# Altium schematic sheet RUMBA_plus.SchDoc
size 635 x 457 mm; PageSetup: Record=PageOptions|CenterHorizontal=True|CenterVertical=True|PrintScale=0.68|XCorrection=1.00|YCorrection=1.00|PrintKind=1|BorderSize=5000000|LeftOffset=0|BottomOffset=0|Orientation=2|PaperLength=1000|PaperWidth=1000|Scale=100|PaperSource=7|PrintQuality=-4|MediaType=1|DitherType=10|PrintScaleMode=1|PaperKind=A3
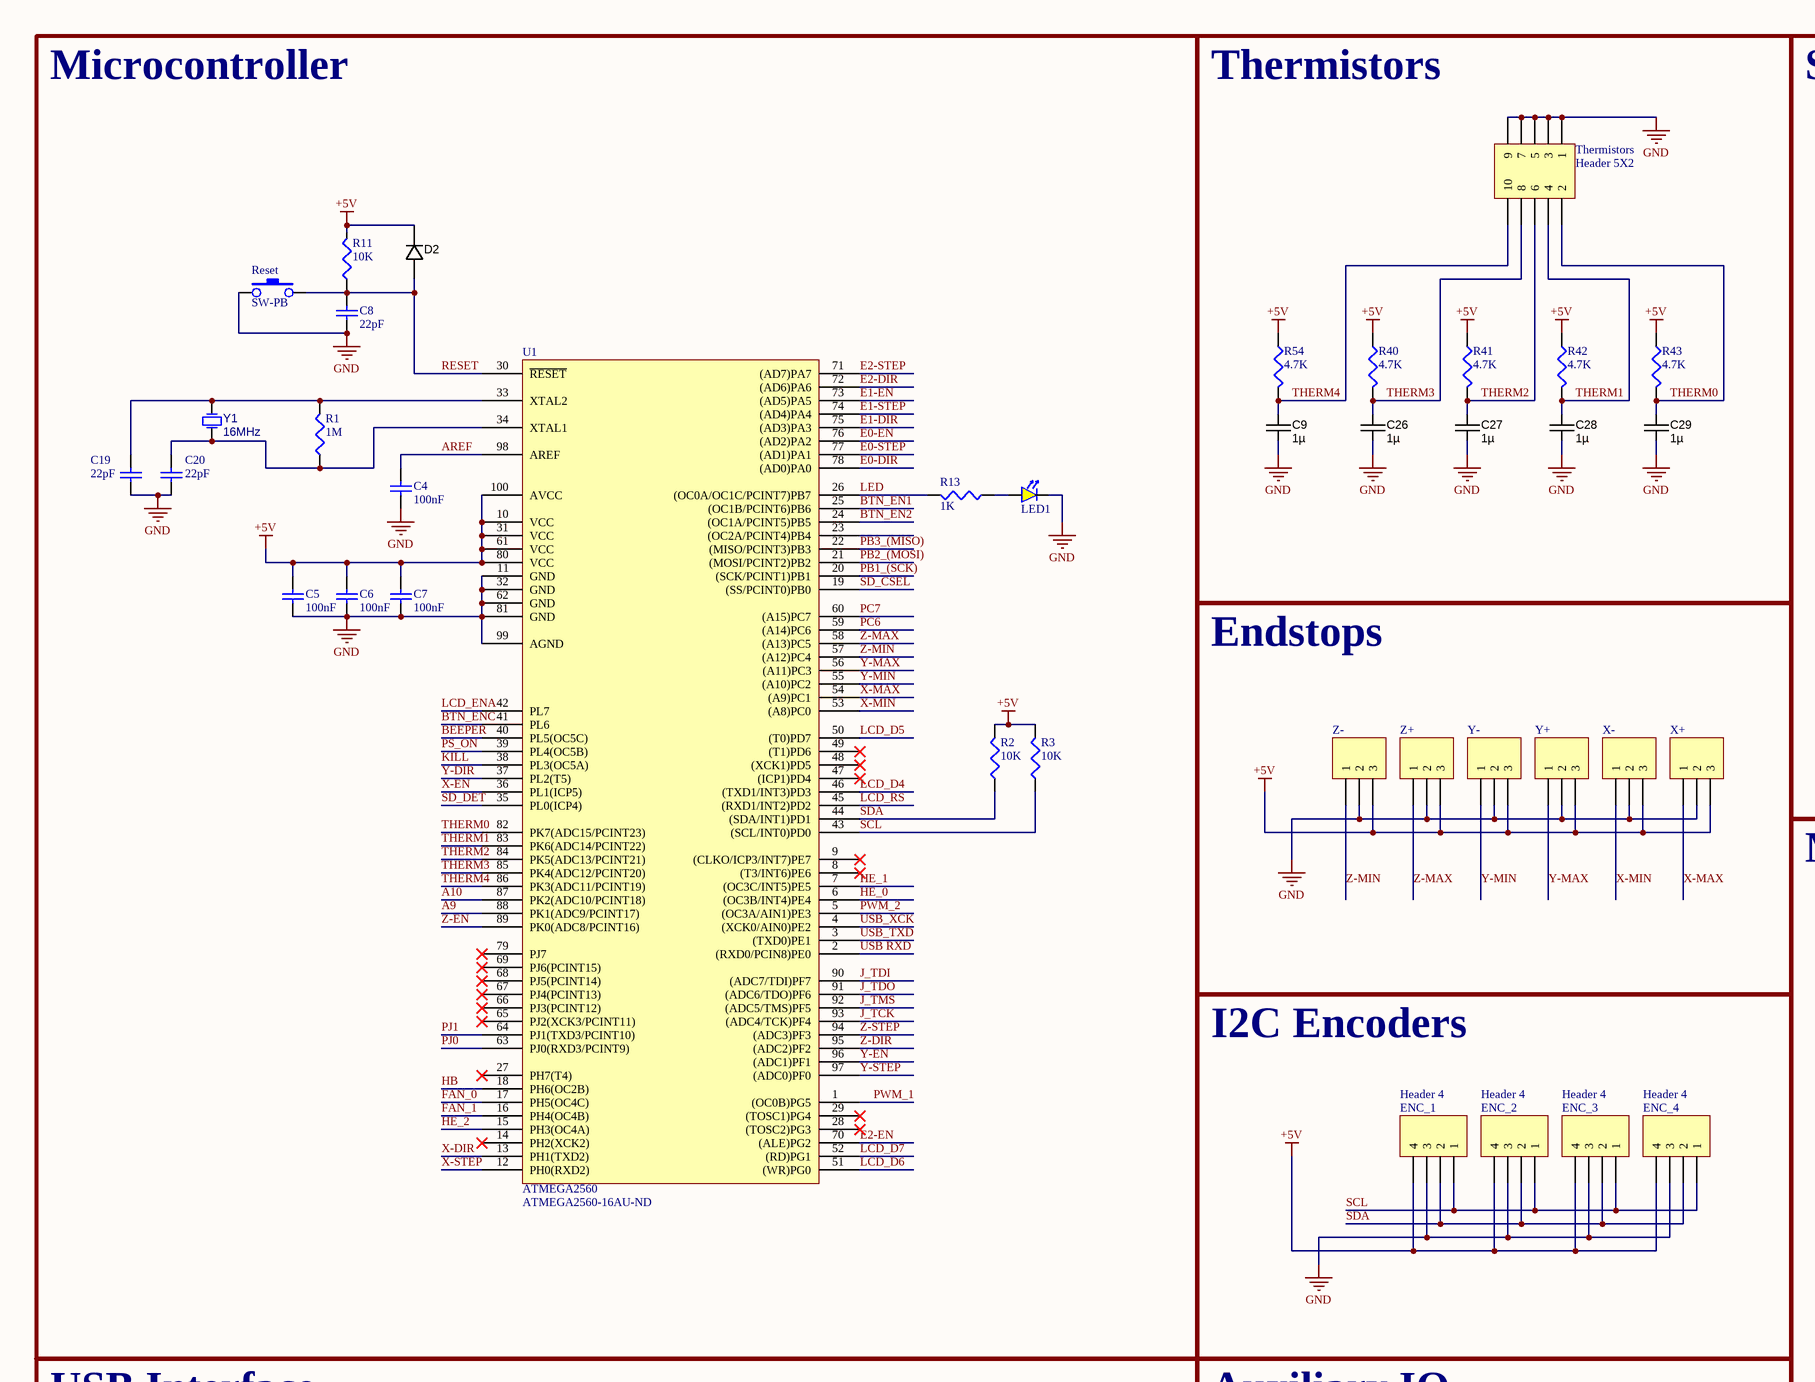
[diagram p0: RUMBA_plus.SchDoc, top left]
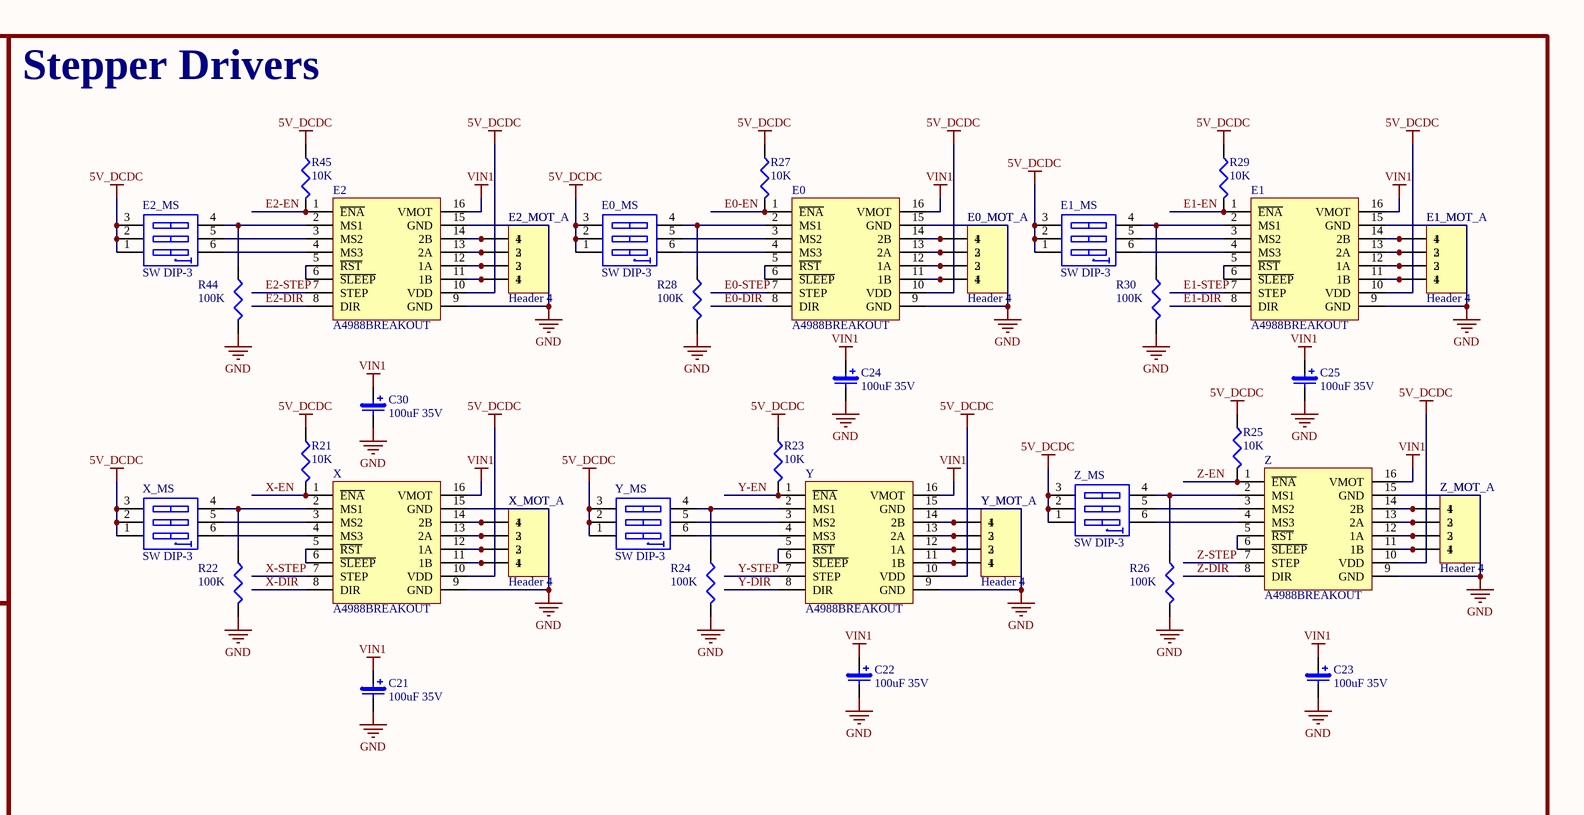
[diagram p1: RUMBA_plus.SchDoc, top right]
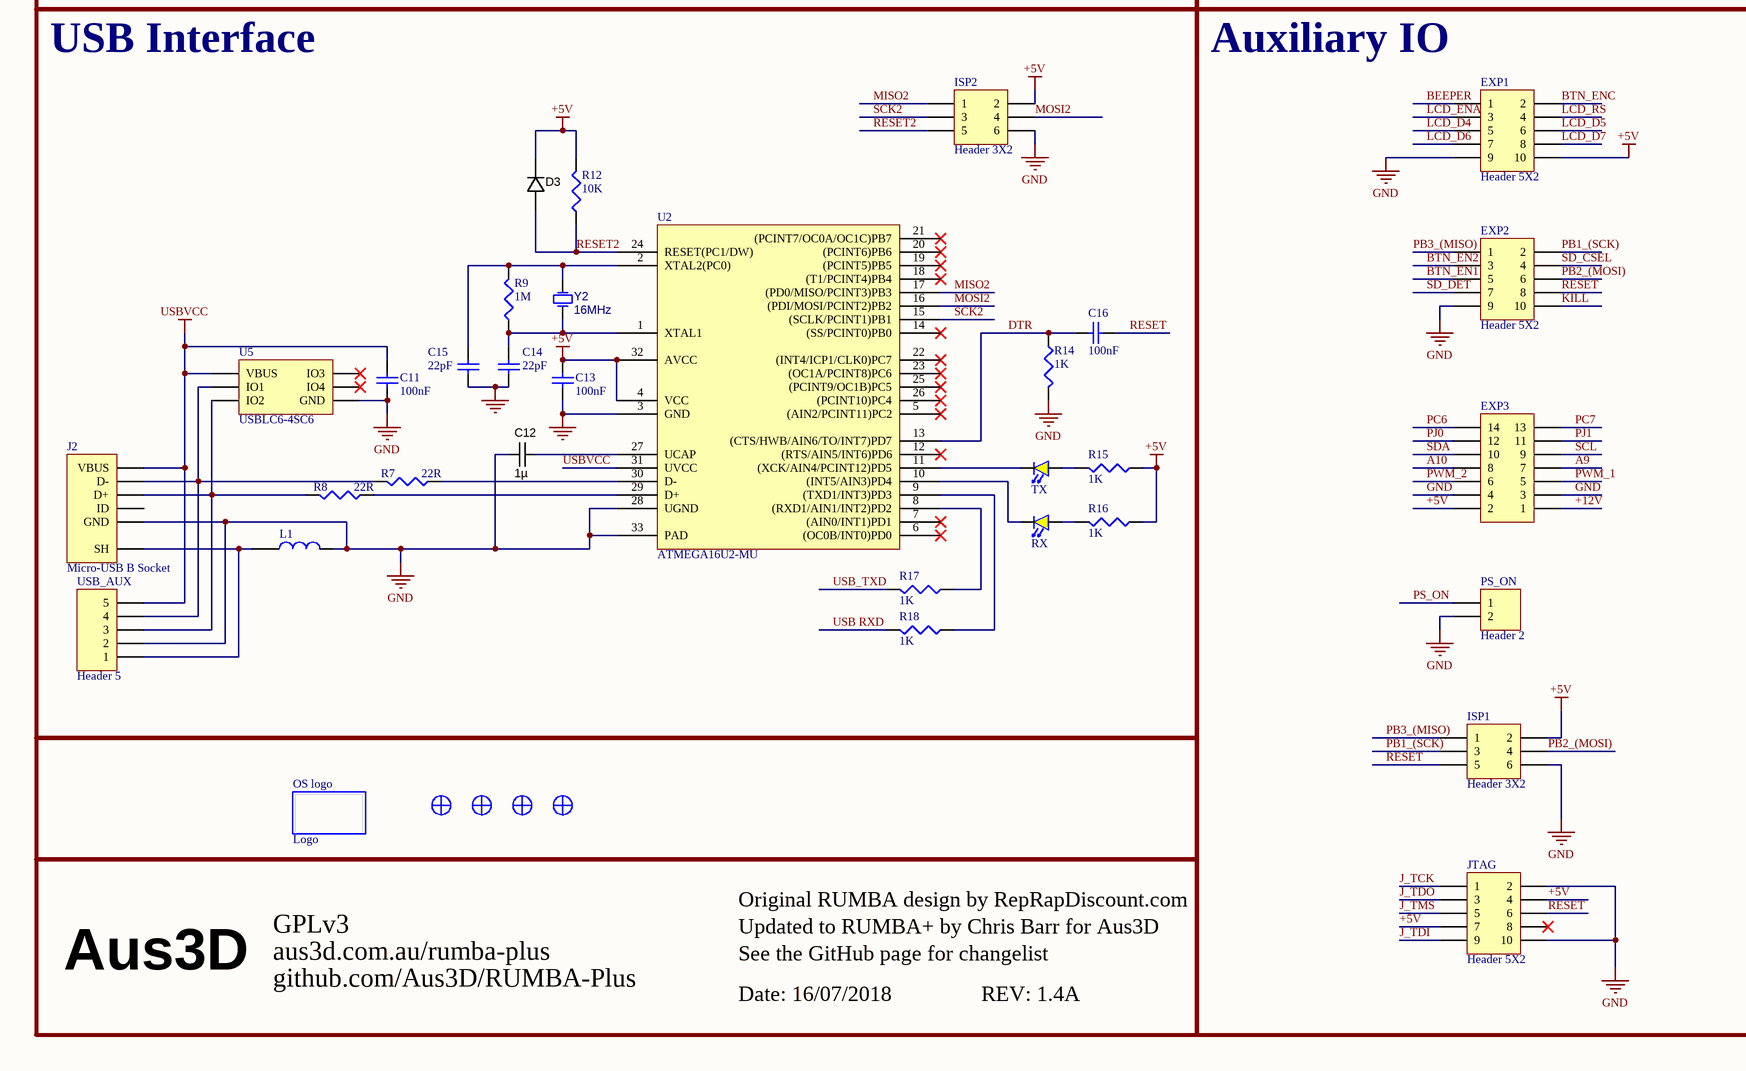
[diagram p2: RUMBA_plus.SchDoc, bottom left]
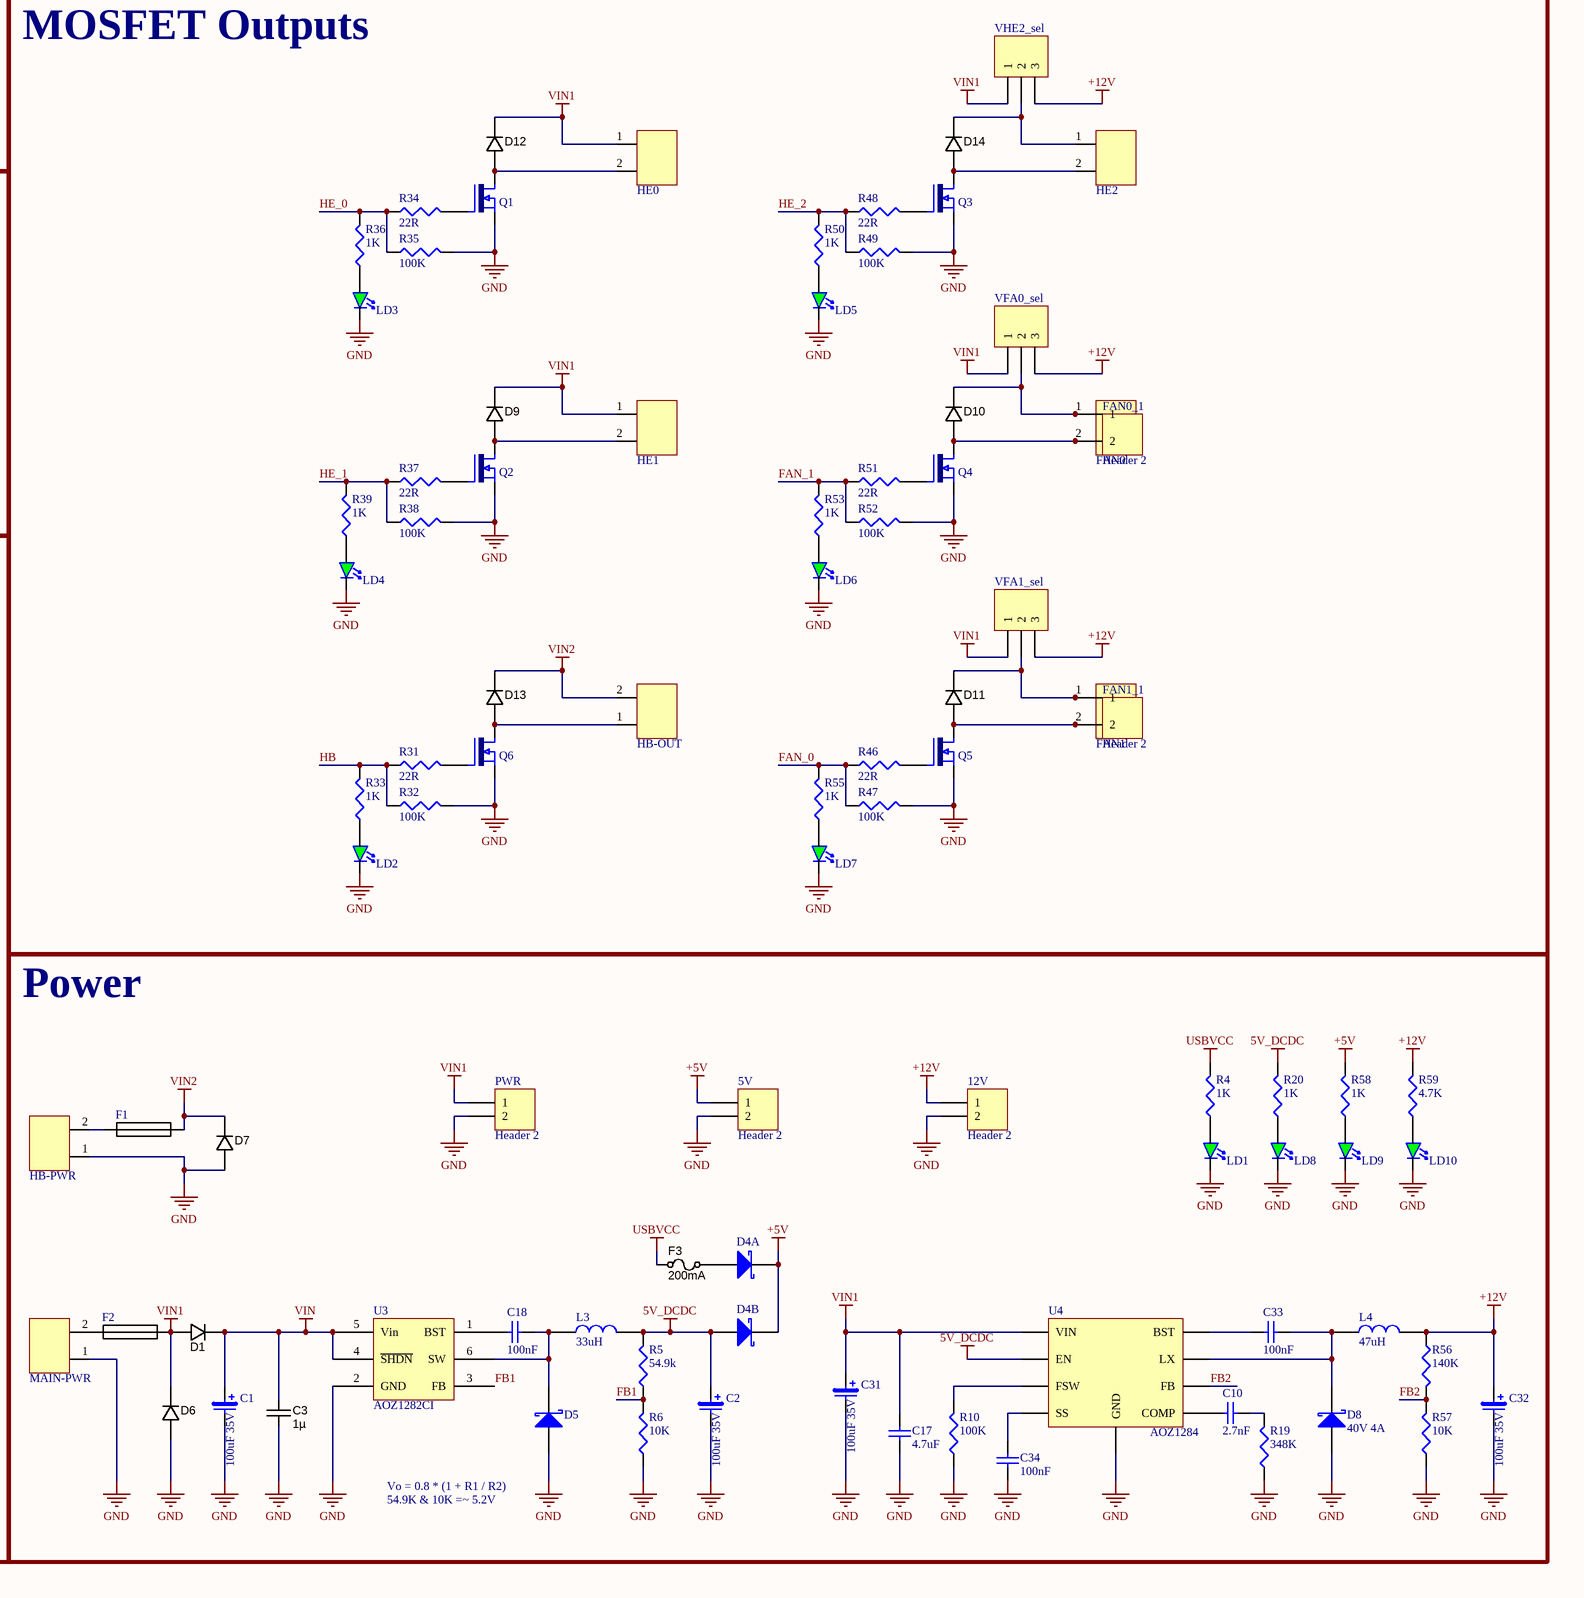
[diagram p3: RUMBA_plus.SchDoc, bottom right]

## Parts
5V  Header 2  [HDR1X2]
12V  Header 2  [HDR1X2]
C1  value 100uF 35V  [CAP EL PANASONIC]  (hidden comment: CapE-6.3-100uF-35V)
C2  value 100uF 35V  [CAP EL PANASONIC]  (hidden comment: CapE-6.3-100uF-35V)
C3  value 1µ  [Cap 1608-0603]  (hidden comment: approved sub OK)
C4  value 100nF  [Cap 1608-0603]  (hidden comment: CapC-0603-100nF)
C5  value 100nF  [Cap 1608-0603]  (hidden comment: CapC-0603-100nF)
C6  value 100nF  [Cap 1608-0603]  (hidden comment: CapC-0603-100nF)
C7  value 100nF  [Cap 1608-0603]  (hidden comment: CapC-0603-100nF)
C8  value 22pF  [Cap 1608-0603]  (hidden comment: CapC-0603-22pF)
C9  value 1µ  [Cap 1608-0603]  (hidden comment: approved sub OK)
C10  value 2.7nF  [Cap 1608-0603]  (hidden comment: CapC-0603-2.7nF)
C11  value 100nF  [Cap 1608-0603]  (hidden comment: CapC-0603-100nF)
C12  value 1µ  [Cap 1608-0603]  (hidden comment: approved sub OK)
C13  value 100nF  [Cap 1608-0603]  (hidden comment: CapC-0603-100nF)
C14  value 22pF  [Cap 1608-0603]  (hidden comment: CapC-0603-22pF)
C15  value 22pF  [Cap 1608-0603]  (hidden comment: CapC-0603-22pF)
C16  value 100nF  [Cap 1608-0603]  (hidden comment: CapC-0603-100nF)
C17  value 4.7uF  [CAP 3225-1210]  (hidden comment: CapC-1210-4.7uF-50V)
C18  value 100nF  [Cap 1608-0603]  (hidden comment: CapC-0603-100nF)
C19  value 22pF  [Cap 1608-0603]  (hidden comment: CapC-0603-22pF)
C20  value 22pF  [Cap 1608-0603]  (hidden comment: CapC-0603-22pF)
C21  value 100uF 35V  [CAP EL PANASONIC]  (hidden comment: CapE-6.3-100uF-35V)
C22  value 100uF 35V  [CAP EL PANASONIC]  (hidden comment: CapE-6.3-100uF-35V)
C23  value 100uF 35V  [CAP EL PANASONIC]  (hidden comment: CapE-6.3-100uF-35V)
C24  value 100uF 35V  [CAP EL PANASONIC]  (hidden comment: CapE-6.3-100uF-35V)
C25  value 100uF 35V  [CAP EL PANASONIC]  (hidden comment: CapE-6.3-100uF-35V)
C26  value 1µ  [Cap 1608-0603]  (hidden comment: approved sub OK)
C27  value 1µ  [Cap 1608-0603]  (hidden comment: approved sub OK)
C28  value 1µ  [Cap 1608-0603]  (hidden comment: approved sub OK)
C29  value 1µ  [Cap 1608-0603]  (hidden comment: approved sub OK)
C30  value 100uF 35V  [CAP EL PANASONIC]  (hidden comment: CapE-6.3-100uF-35V)
C31  value 100uF 35V  [CAP EL PANASONIC]  (hidden comment: CapE-6.3-100uF-35V)
C32  value 100uF 35V  [CAP EL PANASONIC]  (hidden comment: CapE-6.3-100uF-35V)
C33  value 100nF  [Cap 1608-0603]  (hidden comment: CapC-0603-100nF)
C34  value 100nF  [Cap 1608-0603]  (hidden comment: CapC-0603-100nF)
D1  100V; 1.5A  [DO-214AC]  (value not drawn)
D2  DIODE_75V_500mW  [SOD323]  (value not drawn)
D3  DIODE_75V_500mW  [SOD323]  (value not drawn)
D4  Diode Schottky 2A 20V Dual Common Cathode  [SOT1061]  (value not drawn)  (parts A,B of 2)
D5  Diode Schottky 2A 40V  [DIOM2616X08N]  (value not drawn)
D6  100V; 1.5A  [DO-214AC]  (value not drawn)
D7  100V; 1.5A  [DO-214AC]  (value not drawn)
D8  value 40V 4A  [DO-214AA]  (hidden comment: Diode SSB44-E3)
D9  100V; 1.5A  [DO-214AC]  (value not drawn)
D10  100V; 1.5A  [DO-214AC]  (value not drawn)
D11  100V; 1.5A  [DO-214AC]  (value not drawn)
D12  100V; 1.5A  [DO-214AC]  (value not drawn)
D13  100V; 1.5A  [DO-214AC]  (value not drawn)
D14  100V; 1.5A  [DO-214AC]  (value not drawn)
E0  A4988BREAKOUT  [A4988BREAKOUT]
E0_MOT  ScrewTerminal-3.5mm-4Way  [TERM4 3.5mm]  (value not drawn)
E0_MOT_A  Header 4  [HDR1X4]
E0_MS  SW DIP-3  [dipsw SO6]
E1  A4988BREAKOUT  [A4988BREAKOUT]
E1_MOT  ScrewTerminal-3.5mm-4Way  [TERM4 3.5mm]  (value not drawn)
E1_MOT_A  Header 4  [HDR1X4]
E1_MS  SW DIP-3  [dipsw SO6]
E2  A4988BREAKOUT  [A4988BREAKOUT]
E2_MOT  ScrewTerminal-3.5mm-4Way  [TERM4 3.5mm]  (value not drawn)
E2_MOT_A  Header 4  [HDR1X4]
E2_MS  SW DIP-3  [dipsw SO6]
ENC_1  Header 4  [HDR1X4]
ENC_2  Header 4  [HDR1X4]
ENC_3  Header 4  [HDR1X4]
ENC_4  Header 4  [HDR1X4]
EXP1  Header 5X2  [HDR2X5_exp Iner only\]
EXP2  Header 5X2  [HDR2X5_exp Iner only\]
EXP3  Header 7X2  [HDR2X7]  (value not drawn)
F1  Fuseholder - Mini ATC ATO 15A  [Fuseholder - BK-6013 - Mini ATC ATO Blade 15A]  (value not drawn)
F2  Fuseholder - Mini ATC ATO 15A  [Fuseholder - BK-6013 - Mini ATC ATO Blade 15A]  (value not drawn)
F3  value 200mA  [PTC Fuse1608-0603]  (hidden comment: PTC Resettable Fuse)
FAN0  Screw Terminal 3.5mm 2-Way  [TERM2 3.5mm]  (value not drawn)
FAN0_1  Header 2  [HDR1X2]
FAN1  Screw Terminal 3.5mm 2-Way  [TERM2 3.5mm]  (value not drawn)
FAN1_1  Header 2  [HDR1X2]
HB-OUT  Screw Terminal 5mm 2-Way  [TERM2 5MM]  (value not drawn)
HB-PWR  Screw Terminal 5mm 2-Way  [TERM2 5MM]  (value not drawn)
HE0  Screw Terminal 3.5mm 2-Way  [TERM2 3.5mm]  (value not drawn)
HE1  Screw Terminal 3.5mm 2-Way  [TERM2 3.5mm]  (value not drawn)
HE2  Screw Terminal 3.5mm 2-Way  [TERM2 3.5mm]  (value not drawn)
ISP1  Header 3X2  [HDR2X3]
ISP2  Header 3X2  [HDR2X3]
J2  Micro-USB B Socket  [Micro-USB B Molex 105017-0001]
JTAG  Header 5X2  [HDR2X5]
L1  Ferrite Bead SMD 0805  [Res 2012-0805]  (value not drawn)
L3  value 33uH  [SRN6045TA SMD Inductor]  (hidden comment: Inductor SMD 33uH 2.5A)
L4  value 47uH  [SRN8040TA SMD Inductor]  (hidden comment: Inductor SMD 47uH 2.2A)
LD1  GREEN  [LED 1608-0603]  (value not drawn)
LD2  GREEN  [LED 1608-0603]  (value not drawn)
LD3  GREEN  [LED 1608-0603]  (value not drawn)
LD4  GREEN  [LED 1608-0603]  (value not drawn)
LD5  GREEN  [LED 1608-0603]  (value not drawn)
LD6  GREEN  [LED 1608-0603]  (value not drawn)
LD7  GREEN  [LED 1608-0603]  (value not drawn)
LD8  GREEN  [LED 1608-0603]  (value not drawn)
LD9  GREEN  [LED 1608-0603]  (value not drawn)
LD10  GREEN  [LED 1608-0603]  (value not drawn)
LED1  YELLOW  [LED 1608-0603]  (value not drawn)
MAIN-PWR  Screw Terminal 5mm 2-Way  [TERM2 5MM]  (value not drawn)
OS_logo  Logo  [OS LOGO TOP]  (no BOM)
PS_ON  Header 2  [HDR1X2]
PWR  Header 2  [HDR1X2]
Q1  BUK9Y21-40E  [LFPACK]  (value not drawn)
Q2  BUK9Y21-40E  [LFPACK]  (value not drawn)
Q3  BUK9Y21-40E  [LFPACK]  (value not drawn)
Q4  BUK9Y21-40E  [LFPACK]  (value not drawn)
Q5  BUK9Y21-40E  [LFPACK]  (value not drawn)
Q6  PSMN1R8-40YLC  [LFPACK]  (value not drawn)
R1  value 1M  [RES 1608-0603]  (hidden comment: Res-0603-1M)
R2  value 10K  [RES 1608-0603]  (hidden comment: Res-0603-10K)
R3  value 10K  [RES 1608-0603]  (hidden comment: Res-0603-10K)
R4  value 1K  [RES 1608-0603]  (hidden comment: Res-0603-1K)
R5  value 54.9k  [RES 1608-0603]  (hidden comment: Res-0603-54K9)
R6  value 10K  [RES 1608-0603]  (hidden comment: Res-0603-10K)
R7  value 22R  [RES 1608-0603]  (hidden comment: Res-0603-22R)
R8  value 22R  [RES 1608-0603]  (hidden comment: Res-0603-22R)
R9  value 1M  [RES 1608-0603]  (hidden comment: Res-0603-1M)
R10  value 100K  [RES 1608-0603]  (hidden comment: Res-0603-100K)
R11  value 10K  [RES 1608-0603]  (hidden comment: Res-0603-10K)
R12  value 10K  [RES 1608-0603]  (hidden comment: Res-0603-10K)
R13  value 1K  [RES 1608-0603]  (hidden comment: Res-0603-1K)
R14  value 1K  [RES 1608-0603]  (hidden comment: Res-0603-1K)
R15  value 1K  [RES 1608-0603]  (hidden comment: Res-0603-1K)
R16  value 1K  [RES 1608-0603]  (hidden comment: Res-0603-1K)
R17  value 1K  [RES 1608-0603]  (hidden comment: Res-0603-1K)
R18  value 1K  [RES 1608-0603]  (hidden comment: Res-0603-1K)
R19  value 348K  [RES 1608-0603]  (hidden comment: Res-0603-348K)
R20  value 1K  [RES 1608-0603]  (hidden comment: Res-0603-1K)
R21  value 10K  [RES 1608-0603]  (hidden comment: Res-0603-10K)
R22  value 100K  [RES 1608-0603]  (hidden comment: Res-0603-100K)
R23  value 10K  [RES 1608-0603]  (hidden comment: Res-0603-10K)
R24  value 100K  [RES 1608-0603]  (hidden comment: Res-0603-100K)
R25  value 10K  [RES 1608-0603]  (hidden comment: Res-0603-10K)
R26  value 100K  [RES 1608-0603]  (hidden comment: Res-0603-100K)
R27  value 10K  [RES 1608-0603]  (hidden comment: Res-0603-10K)
R28  value 100K  [RES 1608-0603]  (hidden comment: Res-0603-100K)
R29  value 10K  [RES 1608-0603]  (hidden comment: Res-0603-10K)
R30  value 100K  [RES 1608-0603]  (hidden comment: Res-0603-100K)
R31  value 22R  [RES 1608-0603]  (hidden comment: Res-0603-22R)
R32  value 100K  [RES 1608-0603]  (hidden comment: Res-0603-100K)
R33  value 1K  [RES 1608-0603]  (hidden comment: Res-0603-1K)
R34  value 22R  [RES 1608-0603]  (hidden comment: Res-0603-22R)
R35  value 100K  [RES 1608-0603]  (hidden comment: Res-0603-100K)
R36  value 1K  [RES 1608-0603]  (hidden comment: Res-0603-1K)
R37  value 22R  [RES 1608-0603]  (hidden comment: Res-0603-22R)
R38  value 100K  [RES 1608-0603]  (hidden comment: Res-0603-100K)
R39  value 1K  [RES 1608-0603]  (hidden comment: Res-0603-1K)
R40  value 4.7K  [RES 1608-0603]  (hidden comment: Res-0603-4K7)
R41  value 4.7K  [RES 1608-0603]  (hidden comment: Res-0603-4K7)
R42  value 4.7K  [RES 1608-0603]  (hidden comment: Res-0603-4K7)
R43  value 4.7K  [RES 1608-0603]  (hidden comment: Res-0603-4K7)
R44  value 100K  [RES 1608-0603]  (hidden comment: Res-0603-100K)
R45  value 10K  [RES 1608-0603]  (hidden comment: Res-0603-10K)
R46  value 22R  [RES 1608-0603]  (hidden comment: Res-0603-22R)
R47  value 100K  [RES 1608-0603]  (hidden comment: Res-0603-100K)
R48  value 22R  [RES 1608-0603]  (hidden comment: Res-0603-22R)
R49  value 100K  [RES 1608-0603]  (hidden comment: Res-0603-100K)
R50  value 1K  [RES 1608-0603]  (hidden comment: Res-0603-1K)
R51  value 22R  [RES 1608-0603]  (hidden comment: Res-0603-22R)
R52  value 100K  [RES 1608-0603]  (hidden comment: Res-0603-100K)
R53  value 1K  [RES 1608-0603]  (hidden comment: Res-0603-1K)
R54  value 4.7K  [RES 1608-0603]  (hidden comment: Res-0603-4K7)
R55  value 1K  [RES 1608-0603]  (hidden comment: Res-0603-1K)
R56  value 140K  [RES 1608-0603]  (hidden comment: Res-0603-140K)
R57  value 10K  [RES 1608-0603]  (hidden comment: Res-0603-10K)
R58  value 1K  [RES 1608-0603]  (hidden comment: Res-0603-1K)
R59  value 4.7K  [RES 1608-0603]  (hidden comment: Res-0603-4K7)
Reset  SW-PB  [SW-PB SMD 2pin]
RX  YELLOW  [LED 1608-0603]  (value not drawn)
sc1  Sraf  [Sraf 3mm - rupa 3.2]  (value not drawn)  (no BOM)
sc2  Sraf  [Sraf 3mm - rupa 3.2]  (value not drawn)  (no BOM)
sc3  Sraf  [Sraf 3mm - rupa 3.5]  (value not drawn)  (no BOM)
sc4  Sraf  [Sraf 3mm - rupa 3.5]  (value not drawn)  (no BOM)
Thermistors  Header 5X2  [HDR2X5]
TX  YELLOW  [LED 1608-0603]  (value not drawn)
U1  ATMEGA2560  Supplier Part Number 1: ATMEGA2560-16AU-ND  [TQFP100N]
U2  ATMEGA16U2-MU  [32M1-A_N]
U3  AOZ1282CI  [SOT23-6N]
U4  AOZ1284  [SOIC127P600X170_HS-9N]  (value not drawn)
U5  USBLC6-4SC6  [SOT23-6N]
USB_AUX  Header 5  [HDR1X5-HEADER]
VFA0_sel  Header 3  [HDR1X3]  (value not drawn)
VFA1_sel  Header 3  [HDR1X3]  (value not drawn)
VHE2_sel  Header 3  [HDR1X3]  (value not drawn)
X  A4988BREAKOUT  [A4988BREAKOUT]
X+  Header 3  [HDR1X3]  (value not drawn)
X-  Header 3  [HDR1X3]  (value not drawn)
X_MOT  ScrewTerminal-3.5mm-4Way  [TERM4 3.5mm]  (value not drawn)
X_MOT_A  Header 4  [HDR1X4]
X_MS  SW DIP-3  [dipsw SO6]
Y  A4988BREAKOUT  [A4988BREAKOUT]
Y1  16MHz  [3525 SMD Crystal]
Y2  16MHz  [3525 SMD Crystal]
Y+  Header 3  [HDR1X3]  (value not drawn)
Y-  Header 3  [HDR1X3]  (value not drawn)
Y_MOT  ScrewTerminal-3.5mm-4Way  [TERM4 3.5mm]  (value not drawn)
Y_MOT_A  Header 4  [HDR1X4]
Y_MS  SW DIP-3  [dipsw SO6]
Z  A4988BREAKOUT  [A4988BREAKOUT]
Z+  Header 3  [HDR1X3]  (value not drawn)
Z-  Header 3  [HDR1X3]  (value not drawn)
Z_MOT  ScrewTerminal-3.5mm-4Way  [TERM4 3.5mm]  (value not drawn)
Z_MOT_A  Header 4  [HDR1X4]
Z_MS  SW DIP-3  [dipsw SO6]

## Blocks framed on the sheet
Microcontroller: C4-C8 C19 C20 D2 LED1 R1-R3 R11 R13 Reset U1 Y1
Thermistors: C9 C26-C29 R40-R43 R54 Thermistors
Stepper Drivers: C21-C25 C30 E0 E0_MOT E0_MOT_A E0_MS E1 E1_MOT E1_MOT_A E1_MS E2 E2_MOT E2_MOT_A E2_MS R21-R30 R44 R45 X X_MOT X_MOT_A X_MS Y Y_MOT Y_MOT_A Y_MS Z Z_MOT Z_MOT_A Z_MS
Endstops: X+ X- Y+ Y- Z+ Z-
MOSFET Outputs: D9-D14 FAN0 FAN0_1 FAN1 FAN1_1 HB-OUT HE0-HE2 LD2-LD7 Q1-Q6 R31-R39 R46-R53 R55 VFA0_sel VFA1_sel VHE2_sel
I2C Encoders: ENC_1-ENC_4
USB Interface: C11-C16 D3 ISP2 J2 L1 R7-R9 R12 R14-R18 RX TX U2 U5 USB_AUX Y2
Auxiliary IO: EXP1-EXP3 ISP1 JTAG PS_ON
Power: 5V 12V C1-C3 C10 C17 C18 C31-C34 D1 D4-D8 F1-F3 HB-PWR L3 L4 LD1 LD8-LD10 MAIN-PWR PWR R4-R6 R10 R19 R20 R56-R59 U3 U4

## Nets
5V_DCDC: C2.1 D4.2(A) E0.10(VDD) E0_MS.1(A1) E0_MS.2(A2) E0_MS.3(A3) E1.10(VDD) E1_MS.1(A1) E1_MS.2(A2) E1_MS.3(A3) E2.10(VDD) E2_MS.1(A1) E2_MS.2(A2) E2_MS.3(A3) L3.2 R5.2 R20.2 R21.1 R23.1 R25.1 R27.1 R29.1 R45.1 U4.8(EN) X.10(VDD) X_MS.1(A1) X_MS.2(A2) X_MS.3(A3) Y.10(VDD) Y_MS.1(A1) Y_MS.2(A2) Y_MS.3(A3) Z.10(VDD) Z_MS.1(A1) Z_MS.2(A2) Z_MS.3(A3)
+5V: 5V.1 C5.2 C6.2 C7.2 C13.2 D2.K D3.K D4.3(K) ENC_1.4 ENC_2.4 ENC_3.4 ENC_4.4 EXP1.10 EXP3.2 ISP1.2 ISP2.2 JTAG.4 JTAG.7 R2.2 R3.2 R11.2 R12.2 R15.1 R16.1 R40.1 R41.1 R42.1 R43.1 R54.1 R58.2 U1.10(VCC) U1.31(VCC) U1.61(VCC) U1.80(VCC) U1.100(AVCC) U2.4(VCC) U2.32(AVCC) X+.3 X-.3 Y+.3 Y-.3 Z+.3 Z-.3
+12V: 12V.1 C32.1 EXP3.1 L4.2 R56.1 R59.2 VFA0_sel.3 VFA1_sel.3 VHE2_sel.3
GND: 5V.2 12V.2 C1.2 C2.2 C3.2 C4.1 C5.1 C6.1 C7.1 C8.1 C9.2 C11.1 C12.2 C13.1 C14.1 C15.1 C17.1 C19.1 C20.1 C21.2 C22.2 C23.2 C24.2 C25.2 C26.2 C27.2 C28.2 C29.2 C30.2 C31.2 C32.2 C34.1 D5.A D6.A D7.A D8.A E0.9(GND) E0.15(GND) E1.9(GND) E1.15(GND) E2.9(GND) E2.15(GND) ENC_1.3 ENC_2.3 ENC_3.3 ENC_4.3 EXP1.9 EXP2.9 EXP3.3 EXP3.4 HB-PWR.1 ISP1.6 ISP2.6 J2.GND JTAG.2 JTAG.10 L1.2 LD1.2(K) LD2.2(K) LD3.2(K) LD4.2(K) LD5.2(K) LD6.2(K) LD7.2(K) LD8.2(K) LD9.2(K) LD10.2(K) LED1.2(K) MAIN-PWR.1 PS_ON.2 PWR.2 Q1.3(S) Q2.3(S) Q3.3(S) Q4.3(S) Q5.3(S) Q6.3(S) R6.1 R10.1 R14.2 R19.1 R22.2 R24.2 R26.2 R28.2 R30.2 R32.2 R35.2 R38.2 R44.2 R47.2 R49.2 R52.2 R57.1 Reset.1 Thermistors.1 Thermistors.3 Thermistors.5 Thermistors.7 Thermistors.9 U1.11(GND) U1.32(GND) U1.62(GND) U1.81(GND) U1.99(AGND) U2.3(GND) U2.28(UGND) U2.33(PAD) U3.2(GND) U4.3(GND) U5.2(GND) USB_AUX.2 X.9(GND) X.15(GND) X+.2 X-.2 Y.9(GND) Y.15(GND) Y+.2 Y-.2 Z.9(GND) Z.15(GND) Z+.2 Z-.2
USBVCC: C11.2 F3.1 J2.VBUS R4.2 U2.31(UVCC) U5.5(VBUS) USB_AUX.5
VIN: C1.1 C3.1 D1.K U3.4(~{SHDN}) U3.5(Vin)
VIN1: C17.2 C21.1 C22.1 C23.1 C24.1 C25.1 C30.1 C31.1 D1.A D6.K D9.K D12.K E0.16(VMOT) E1.16(VMOT) E2.16(VMOT) F2.1 HE0.1 HE1.1 PWR.1 U4.9(VIN) VFA0_sel.1 VFA1_sel.1 VHE2_sel.1 X.16(VMOT) Y.16(VMOT) Z.16(VMOT)
VIN2: D7.K D13.K F1.1 HB-OUT.2
A9: EXP3.7 U1.88(PK1(ADC9/PCINT17))
A10: EXP3.8 U1.87(PK2(ADC10/PCINT18))
AREF: C4.2 U1.98(AREF)
BEEPER: EXP1.1 U1.40(PL5(OC5C))
BTN_EN1: EXP2.5 U1.25((OC1B/PCINT6)PB6)
BTN_EN2: EXP2.3 U1.24((OC1A/PCINT5)PB5)
BTN_ENC: EXP1.2 U1.41(PL6)
DTR: C16.2 R14.1 U2.13((CTS/HWB/AIN6/TO/INT7)PD7)
E0-DIR: E0.8(DIR) U1.78((AD0)PA0)
E0-EN: E0.1(~{ENA}) R27.2 U1.76((AD2)PA2)
E0-STEP: E0.7(STEP) U1.77((AD1)PA1)
E1-DIR: E1.8(DIR) U1.75((AD3)PA3)
E1-EN: E1.1(~{ENA}) R29.2 U1.73((AD5)PA5)
E1-STEP: E1.7(STEP) U1.74((AD4)PA4)
E2-DIR: E2.8(DIR) U1.72((AD6)PA6)
E2-EN: E2.1(~{ENA}) R45.2 U1.70((ALE)PG2)
E2-STEP: E2.7(STEP) U1.71((AD7)PA7)
FAN_0: R46.1 R47.1 R55.2 U1.17(PH5(OC4C))
FAN_1: R51.1 R52.1 R53.2 U1.16(PH4(OC4B))
FB1: R5.1 R6.2 U3.3(FB)
FB2: R56.2 R57.2 U4.6(FB)
HB: R31.1 R32.1 R33.2 U1.18(PH6(OC2B))
HE_0: R34.1 R35.1 R36.2 U1.6((OC3B/INT4)PE4)
HE_1: R37.1 R38.1 R39.2 U1.7((OC3C/INT5)PE5)
HE_2: R48.1 R49.1 R50.2 U1.15(PH3(OC4A))
J_TCK: JTAG.1 U1.93((ADC4/TCK)PF4)
J_TDI: JTAG.9 U1.90((ADC7/TDI)PF7)
J_TDO: JTAG.3 U1.91((ADC6/TDO)PF6)
J_TMS: JTAG.5 U1.92((ADC5/TMS)PF5)
KILL: EXP2.10 U1.38(PL3(OC5A))
LCD_D4: EXP1.5 U1.46((TXD1/INT3)PD3)
LCD_D5: EXP1.6 U1.50((T0)PD7)
LCD_D6: EXP1.7 U1.51((WR)PG0)
LCD_D7: EXP1.8 U1.52((RD)PG1)
LCD_ENA: EXP1.3 U1.42(PL7)
LCD_RS: EXP1.4 U1.45((RXD1/INT2)PD2)
LED: R13.2 U1.26((OC0A/OC1C/PCINT7)PB7)
MISO2: ISP2.1 U2.17((PD0/MISO/PCINT3)PB3)
MOSI2: ISP2.4 U2.16((PDI/MOSI/PCINT2)PB2)
PB1_(SCK): EXP2.2 ISP1.3 U1.20((SCK/PCINT1)PB1)
PB2_(MOSI): EXP2.6 ISP1.4 U1.21((MOSI/PCINT2)PB2)
PB3_(MISO): EXP2.1 ISP1.1 U1.22((MISO/PCINT3)PB3)
PC6: EXP3.14 U1.59((A14)PC6)
PC7: EXP3.13 U1.60((A15)PC7)
PJ0: EXP3.12 U1.63(PJ0(RXD3/PCINT9))
PJ1: EXP3.11 U1.64(PJ1(TXD3/PCINT10))
PS_ON: PS_ON.1 U1.39(PL4(OC5B))
PWM_1: EXP3.5 U1.1((OC0B)PG5)
PWM_2: EXP3.6 U1.5((OC3A/AIN1)PE3)
RESET: C8.2 C16.1 D2.A EXP2.8 ISP1.5 JTAG.6 R11.1 Reset.2 U1.30(~{RESET})
RESET2: D3.A ISP2.5 R12.1 U2.24(RESET(PC1/DW))
SCK2: ISP2.3 U2.15((SCLK/PCINT1)PB1)
SCL: ENC_1.1 ENC_2.1 ENC_3.1 ENC_4.1 EXP3.9 R3.1 U1.43((SCL/INT0)PD0)
SD_CSEL: EXP2.4 U1.19((SS/PCINT0)PB0)
SD_DET: EXP2.7 U1.35(PL0(ICP4))
SDA: ENC_1.2 ENC_2.2 ENC_3.2 ENC_4.2 EXP3.10 R2.1 U1.44((SDA/INT1)PD1)
THERM0: C29.1 R43.2 Thermistors.2 U1.82(PK7(ADC15/PCINT23))
THERM1: C28.1 R42.2 Thermistors.4 U1.83(PK6(ADC14/PCINT22))
THERM2: C27.1 R41.2 Thermistors.6 U1.84(PK5(ADC13/PCINT21))
THERM3: C26.1 R40.2 Thermistors.8 U1.85(PK4(ADC12/PCINT20))
THERM4: C9.1 R54.2 Thermistors.10 U1.86(PK3(ADC11/PCINT19))
USB RXD: R18.2 U1.2((RXD0/PCIN8)PE0)
USB_TXD: R17.2 U1.3((TXD0)PE1)
USB_XCK: U1.4((XCK0/AIN0)PE2)
X-DIR: U1.13(PH1(TXD2)) X.8(DIR)
X-EN: R21.2 U1.36(PL1(ICP5)) X.1(~{ENA})
X-MAX: U1.54((A9)PC1) X+.1
X-MIN: U1.53((A8)PC0) X-.1
X-STEP: U1.12(PH0(RXD2)) X.7(STEP)
Y-DIR: U1.37(PL2(T5)) Y.8(DIR)
Y-EN: R23.2 U1.96((ADC1)PF1) Y.1(~{ENA})
Y-MAX: U1.56((A11)PC3) Y+.1
Y-MIN: U1.55((A10)PC2) Y-.1
Y-STEP: U1.97((ADC0)PF0) Y.7(STEP)
Z-DIR: U1.95((ADC2)PF2) Z.8(DIR)
Z-EN: R25.2 U1.89(PK0(ADC8/PCINT16)) Z.1(~{ENA})
Z-MAX: U1.58((A13)PC5) Z+.1
Z-MIN: U1.57((A12)PC4) Z-.1
Z-STEP: U1.94((ADC3)PF3) Z.7(STEP)
NetC10_1: C10.1 R19.2
NetC10_2: C10.2 U4.5(COMP)
NetC12_1: C12.1 U2.27(UCAP)
NetC14_2: C14.2 R9.1 U2.1(XTAL1) Y2.1(OSC1)
NetC15_2: C15.2 R9.2 U2.2(XTAL2(PC0)) Y2.3(OSC2)
NetC18_1: C18.1 D5.K L3.1 U3.6(SW)
NetC18_2: C18.2 U3.1(BST)
NetC19_2: C19.2 R1.2 U1.33(XTAL2) Y1.3(OSC2)
NetC20_2: C20.2 R1.1 U1.34(XTAL1) Y1.1(OSC1)
NetC33_1: C33.1 U4.2(BST)
NetC33_2: C33.2 D8.K L4.1 U4.1(LX)
NetC34_2: C34.2 U4.7(SS)
NetD4_1: D4.1(A) F3.2
NetD9_A: D9.A HE1.2 Q2.2(D)
NetD10_A: D10.A FAN0.2 FAN0_1.2 Q4.2(D)
NetD10_K: D10.K FAN0.1 FAN0_1.1 VFA0_sel.2
NetD11_A: D11.A FAN1.2 FAN1_1.2 Q5.2(D)
NetD11_K: D11.K FAN1.1 FAN1_1.1 VFA1_sel.2
NetD12_A: D12.A HE0.2 Q1.2(D)
NetD13_A: D13.A HB-OUT.1 Q6.2(D)
NetD14_A: D14.A HE2.2 Q3.2(D)
NetD14_K: D14.K HE2.1 VHE2_sel.2
NetE0_2: E0.2(MS1) E0_MS.4(B3) R28.1
NetE0_3: E0.3(MS2) E0_MS.5(B2)
NetE0_4: E0.4(MS3) E0_MS.6(B1)
NetE0_5: E0.5(~{RST}) E0.6(~{SLEEP})
NetE0_11: E0.11(1B) E0_MOT.1 E0_MOT_A.4
NetE0_12: E0.12(1A) E0_MOT.2 E0_MOT_A.3
NetE0_13: E0.13(2A) E0_MOT.3 E0_MOT_A.2
NetE0_14: E0.14(2B) E0_MOT.4 E0_MOT_A.1
NetE1_2: E1.2(MS1) E1_MS.4(B3) R30.1
NetE1_3: E1.3(MS2) E1_MS.5(B2)
NetE1_4: E1.4(MS3) E1_MS.6(B1)
NetE1_5: E1.5(~{RST}) E1.6(~{SLEEP})
NetE1_11: E1.11(1B) E1_MOT.1 E1_MOT_A.4
NetE1_12: E1.12(1A) E1_MOT.2 E1_MOT_A.3
NetE1_13: E1.13(2A) E1_MOT.3 E1_MOT_A.2
NetE1_14: E1.14(2B) E1_MOT.4 E1_MOT_A.1
NetE2_2: E2.2(MS1) E2_MS.4(B3) R44.1
NetE2_3: E2.3(MS2) E2_MS.5(B2)
NetE2_4: E2.4(MS3) E2_MS.6(B1)
NetE2_5: E2.5(~{RST}) E2.6(~{SLEEP})
NetE2_11: E2.11(1B) E2_MOT.1 E2_MOT_A.4
NetE2_12: E2.12(1A) E2_MOT.2 E2_MOT_A.3
NetE2_13: E2.13(2A) E2_MOT.3 E2_MOT_A.2
NetE2_14: E2.14(2B) E2_MOT.4 E2_MOT_A.1
NetF1_0: F1.0 HB-PWR.2
NetF2_0: F2.0 MAIN-PWR.2
NetJ2_D+: J2.D+ R8.2 U5.3(IO2) USB_AUX.3
NetJ2_D-: J2.D- R7.2 U5.1(IO1) USB_AUX.4
NetJ2_SHIELD: J2.SHIELD(SH) L1.1 USB_AUX.1
NetLD1_1: LD1.1(A) R4.1
NetLD2_1: LD2.1(A) R33.1
NetLD3_1: LD3.1(A) R36.1
NetLD4_1: LD4.1(A) R39.1
NetLD5_1: LD5.1(A) R50.1
NetLD6_1: LD6.1(A) R53.1
NetLD7_1: LD7.1(A) R55.1
NetLD8_1: LD8.1(A) R20.1
NetLD9_1: LD9.1(A) R58.1
NetLD10_1: LD10.1(A) R59.1
NetLED1_1: LED1.1(A) R13.1
NetQ1_1: Q1.1(G) R34.2
NetQ2_1: Q2.1(G) R37.2
NetQ3_1: Q3.1(G) R48.2
NetQ4_1: Q4.1(G) R51.2
NetQ5_1: Q5.1(G) R46.2
NetQ6_1: Q6.1(G) R31.2
NetR7_1: R7.1 U2.30(D-)
NetR8_1: R8.1 U2.29(D+)
NetR10_2: R10.2 U4.4(FSW)
NetR15_2: R15.2 TX.1(A)
NetR16_2: R16.2 RX.1(A)
NetR17_1: R17.1 U2.8((RXD1/AIN1/INT2)PD2)
NetR18_1: R18.1 U2.9((TXD1/INT3)PD3)
NetR22_1: R22.1 X.2(MS1) X_MS.4(B3)
NetR24_1: R24.1 Y.2(MS1) Y_MS.4(B3)
NetR26_1: R26.1 Z.2(MS1) Z_MS.4(B3)
NetRX_2: RX.2(K) U2.10((INT5/AIN3)PD4)
NetTX_2: TX.2(K) U2.11((XCK/AIN4/PCINT12)PD5)
NetX_3: X.3(MS2) X_MS.5(B2)
NetX_4: X.4(MS3) X_MS.6(B1)
NetX_5: X.5(~{RST}) X.6(~{SLEEP})
NetX_11: X.11(1B) X_MOT.1 X_MOT_A.4
NetX_12: X.12(1A) X_MOT.2 X_MOT_A.3
NetX_13: X.13(2A) X_MOT.3 X_MOT_A.2
NetX_14: X.14(2B) X_MOT.4 X_MOT_A.1
NetY_3: Y.3(MS2) Y_MS.5(B2)
NetY_4: Y.4(MS3) Y_MS.6(B1)
NetY_5: Y.5(~{RST}) Y.6(~{SLEEP})
NetY_11: Y.11(1B) Y_MOT.1 Y_MOT_A.4
NetY_12: Y.12(1A) Y_MOT.2 Y_MOT_A.3
NetY_13: Y.13(2A) Y_MOT.3 Y_MOT_A.2
NetY_14: Y.14(2B) Y_MOT.4 Y_MOT_A.1
NetZ_3: Z.3(MS2) Z_MS.5(B2)
NetZ_4: Z.4(MS3) Z_MS.6(B1)
NetZ_5: Z.5(~{RST}) Z.6(~{SLEEP})
NetZ_11: Z.11(1B) Z_MOT.1 Z_MOT_A.4
NetZ_12: Z.12(1A) Z_MOT.2 Z_MOT_A.3
NetZ_13: Z.13(2A) Z_MOT.3 Z_MOT_A.2
NetZ_14: Z.14(2B) Z_MOT.4 Z_MOT_A.1

Not connected (* = marked no-connect by the designer): J2 ID; JTAG 8*; U1 8((T3/INT6)PE6)* 9((CLKO/ICP3/INT7)PE7)* 14(PH2(XCK2))* 23((OC2A/PCINT4)PB4) 27(PH7(T4))* 28((TOSC2)PG3)* 29((TOSC1)PG4)* 47((ICP1)PD4)* 48((XCK1)PD5)* 49((T1)PD6)* 65(PJ2(XCK3/PCINT11))* 66(PJ3(PCINT12))* 67(PJ4(PCINT13))* 68(PJ5(PCINT14))* 69(PJ6(PCINT15))* 79(PJ7)*; U2 5((AIN2/PCINT11)PC2)* 6((OC0B/INT0)PD0)* 7((AIN0/INT1)PD1)* 12((RTS/AIN5/INT6)PD6)* 14((SS/PCINT0)PB0)* 18((T1/PCINT4)PB4)* 19((PCINT5)PB5)* 20((PCINT6)PB6)* 21((PCINT7/OC0A/OC1C)PB7)* 22((INT4/ICP1/CLK0)PC7)* 23((OC1A/PCINT8)PC6)* 25((PCINT9/OC1B)PC5)* 26((PCINT10)PC4)*; U5 4(IO3)* 6(IO4)*

## Notes on the sheet
- GPLv3
- aus3d.com.au/rumba-plus <http://aus3d.com.au/rumba-plus>
- Updated to RUMBA+ by Chris Barr for Aus3D
- Original RUMBA design by RepRapDiscount.com
- See the GitHub page for changelist
- Vo = 0.8 * (1 + R1 / R2)
- Aus3D
- github.com/Aus3D/RUMBA-Plus
- Date: 16/07/2018
- REV: 1.4A
- 54.9K & 10K =~ 5.2V

## Library data of the parts
5V 12V FAN0_1 FAN1_1 PS_ON PWR = Header 2: Header, 2-Pin; Note: Approved sub OK; LatestRevisionDate: 17-Jul-2002; LatestRevisionNote: Re-released for DXP Platform.; Publisher: Altium Limited; Supplier 1: Digi-Key; Supplier Part Number 1: 3M9447-ND
C1 C2 C21-C25 C30-C32 = CapE-6.3-100uF-35V: Polarized Capacitor (Surface Mount); Note: Approved sub OK; Published: 8-Jun-2000; Revision: July-2002: Re-released for DXP Platform.; Publisher: Altium Limited; Supplier 1: Digi-Key; Supplier Part Number 1: PCE5016CT-ND
C3 C9 C12 C26-C29 = CAPC_1u_0603_X7R_16V_10%: Capacitor SMD Cer 1uF 10% 16V X7R 0603; Manufacturer 1: TDK Corporation; Manufacturer Part Number 1: C1608X7R1C105K; Ratings: 16V; X7R; Material: ceramic; SCDType: spec; Package / Case: 0603 (1608 metric); Tolerance: ±10%; Supplier 1: Digi-Key; Supplier Part Number 1: 445-1604-1-ND; ComponentLink1URL: http://product.tdk.com/capacitor/mlcc/en/documents/mlcc_commercial_general_en.pdf; ComponentLink1Description: http://product.tdk.com/capacitor/mlcc/en/documents/mlcc_commercial_general_en.pdf; Note: Approved sub OK
C4-C7 C10 C11 C13 C16 C18 C33 C34 = CapC-0603-100nF: Capacitor (Semiconductor SIM Model); Note: Approved sub OK; Published: 8-Jun-2000; Revision: July-2002: Re-released for DXP Platform.; Publisher: Altium Limited; Supplier 1: Digi-Key; Supplier Part Number 1: 311-1344-1-ND
C8 C14 C15 C19 C20 = CapC-0603-22pF: Capacitor (Semiconductor SIM Model); Note: Approved sub OK; Published: 8-Jun-2000; Revision: July-2002: Re-released for DXP Platform.; Publisher: Altium Limited; Supplier 1: Digi-Key; Supplier Part Number 1: 478-6204-1-ND
C17 = CapC-1210-4.7uF-50V: Capacitor (Semiconductor SIM Model); Note: Approved sub OK; Published: 8-Jun-2000; Revision: July-2002: Re-released for DXP Platform.; Publisher: Altium Limited; Supplier 1: Digi-Key; Supplier Part Number 1: 490-1864-1-ND
D1 D6 D7 D9-D14 = DIODE_100V_1.5A_SMA: Diode SMD 100V 1.5A SMA; Manufacturer 1: Diodes Inc; Manufacturer Part Number 1: S2BA-13-F; Material: Si; Diode Type: Standard; Value: Vf = 1.15V @ 1.5A (Max); SCDType: source; Note: Approved sub OK; Package / Case: DO-214AC, SMA; Ratings: 100V; 1.5A; Supplier 1: Digi-Key; Supplier Part Number 1: S2BA-FDICT-ND
D2 D3 = DIODE_75V_500mW: Diode SMD 300mA 0.5W SOD323; Manufacturer: Micro Commercial Co; Manufacturer Part Number: 1N4148WX-TP; Ratings: 75V; 300mA; 0.5W; Material: Si; Diode Type: Standard; Value: Vf=1V @ 50mA; SCDType: source; Note: Approved sub OK; Package / Case: SOD323; Supplier 1: Digi-Key; Supplier Part Number 1: 1N4148WXTPMSCT-ND
D4 = Diode Schottky 2A 20V Dual Common Cathode: Default Diode; Code - JEDEC: DO-214-AB; VALUE: PMEG2020CPA,115; Note: Approved sub OK; Published: 8-Jun-2000; Revision: July-2002: Re-released for DXP Platform.; Publisher: Altium Limited; Supplier 1: Digi-Key; Supplier Part Number 1: 1727-5194-1-ND
D5 = Diode Schottky 2A 40V: Default Diode; Code - JEDEC: DO-214-AB; Note: Approved sub OK; Published: 8-Jun-2000; Revision: July-2002: Re-released for DXP Platform.; Publisher: Altium Limited; Supplier 1: Digi-Key; Supplier Part Number 1: DB2W40200LCT-ND
D8 = Diode Schottky - 40V 4A - SSB44-E3: Schottky Diode; Code - JEDEC: DO-214-AA; Note: Approved sub OK; Published: 8-Jun-2000; Revision: July-2002: Re-released for DXP Platform.; Publisher: Altium Limited; Supplier 1: Digi-Key; Supplier Part Number 1: SSB44-E3/52TGICT-ND
E0-E2 X Y Z = A4988BREAKOUT: Note: Approved sub OK; Supplier 1: Digi-Key; Supplier Part Number 1: S7006-ND
E0_MOT E1_MOT E2_MOT X_MOT Y_MOT Z_MOT = ScrewTerminal-3.5mm-4Way: Screw Terminal 3.5mm 4-Way; Note: Approved sub OK; LatestRevisionDate: 17-Jul-2002; LatestRevisionNote: Re-released for DXP Platform.; Publisher: Altium Limited; Supplier 1: Digi-Key; Supplier Part Number 1: 277-5744-ND
E0_MOT_A E1_MOT_A E2_MOT_A X_MOT_A Y_MOT_A Z_MOT_A = Header 4_1: Header, 4-Pin; Note: Approved sub OK; LatestRevisionDate: 17-Jul-2002; LatestRevisionNote: Re-released for DXP Platform.; Publisher: Altium Limited; Supplier 1: Digi-Key; Supplier Part Number 1: 3M9449-ND
E0_MS E1_MS E2_MS X_MS Y_MS Z_MS = SW DIP-3: DIP Switch; Note: Approved sub OK; Published: 24-Mar-1999; Revision: July-2002: Re-released for DXP Platform.; Publisher: Altium Limited; Supplier 1: Digi-Key; Supplier Part Number 1: 732-3853-1-ND
ENC_1-ENC_4 = Header 4: Header, 4-Pin; Note: Approved sub OK; LatestRevisionDate: 17-Jul-2002; LatestRevisionNote: Re-released for DXP Platform.; Publisher: Altium Limited
EXP1 EXP2 JTAG Thermistors = Header 5X2: Header, 5-Pin, Dual row; Note: Approved sub OK; LatestRevisionDate: 17-Jul-2002; LatestRevisionNote: Re-released for DXP Platform.; Publisher: Altium Limited; Supplier 1: Digi-Key; Supplier Part Number 1: 3M9460-ND
EXP3 = Header 7X2: Header, 7-Pin, Dual row; Note: Approved sub OK; LatestRevisionDate: 17-Jul-2002; LatestRevisionNote: Re-released for DXP Platform.; Publisher: Altium Limited; Supplier 1: Digi-Key; Supplier Part Number 1: 3M15450-ND
F1 F2 = Fuseholder - Mini ATC ATO 15A: Note: Approved sub OK; Supplier 1: Digi-Key; Supplier Part Number 1: BK-6013-ND
F3 = Fuse - 15V 200mA Trip PTC SMD 0603: Manufacturer 1: Holly Fuse; Manufacturer Part Number 1: 06T-0160L; Ratings: 160mA; 63VDC; slow-blow; SCDType: spec; Note: Approved sub OK; Package / Case: 0603 (1608 metric); Supplier 1: Digi-Key; Supplier Part Number 1: 507-1821-1-ND
FAN0 FAN1 HE0-HE2 = ScrewTerminal-3.5mm-2Way: Note: Approved sub OK; Supplier 1: Digi-Key; Supplier Part Number 1: 277-5719-ND
HB-OUT HB-PWR MAIN-PWR = ScrewTerminal-5mm-2Way: Note: Approved sub OK; Supplier 1: Digi-Key; Supplier Part Number 1: 277-6405-ND
ISP1 ISP2 = Header 3X2: Header, 3-Pin, Dual row; Note: Approved sub OK; LatestRevisionDate: 17-Jul-2002; LatestRevisionNote: Re-released for DXP Platform.; Publisher: Altium Limited; Supplier 1: Digi-Key; Supplier Part Number 1: 3M9459-ND
J2 = Micro-USB B Socket: Note: Approved sub OK; Supplier 1: Digi-Key; Supplier Part Number 1: WM1399CT-ND
L1 = Ferrite Bead SMD 0805: MagneticCore Inductor with Winding Polarity Marking; Value: WE-CBF_0805 (WE-CBF); Note: Approved sub OK; Published: 24-Mar-1999; Revision: July-2002: Re-released for DXP Platform.; Publisher: Altium Limited; Supplier 1: Digi-Key; Supplier Part Number 1: 490-1054-1-ND
L3 = Inductor SMD 33uH 2.5A: MagneticCore Inductor with Winding Polarity Marking; Note: Approved sub OK; Published: 24-Mar-1999; Revision: July-2002: Re-released for DXP Platform.; Publisher: Altium Limited; Supplier 1: Digi-Key; Supplier Part Number 1: SRN6045TA-330MCT-ND
L4 = Inductor SMD 47uH 2.2A: MagneticCore Inductor with Winding Polarity Marking; Note: Approved sub OK; Published: 24-Mar-1999; Revision: July-2002: Re-released for DXP Platform.; Publisher: Altium Limited; Supplier 1: Digi-Key; Supplier Part Number 1: SRN8040TA-470MCT-ND
LD1-LD10 = LEDG  0603: Hyper-Bright LED; Note: Approved sub OK; Supplier 1: Digi-Key; Supplier Part Number 1: 160-1435-2-ND
LED1 RX TX = LEDY  0603: Hyper-Bright LED; Note: Approved sub OK; Supplier 1: Digi-Key; Supplier Part Number 1: 160-1437-1-ND
OS_logo = Logo: Note: Approved sub OK
Q1-Q5 = MOSFET - BUK9Y21-40E: Supplier 1: Digi-Key; Supplier Part Number 1: 1727-1123-1-ND
Q6 = MOSFET - PSMN1R8-40YLC: Supplier 1: Digi-Key; Supplier Part Number 1: 1727-1052-1-ND
R1 R9 = Res-0603-1M: Resistor; Note: Approved sub OK; Published: 8-Jun-2000; Revision: July-2002: Re-released for DXP Platform.; Publisher: Altium Limited; Supplier 1: Digi-Key; Supplier Part Number 1: 311-1.00MHRDKR-ND
R2 R3 R5 R6 R11 R12 R21 R23 R25 R27 R29 R45 R57 = Res-0603-10K: Resistor; Note: Approved sub OK; Published: 8-Jun-2000; Revision: July-2002: Re-released for DXP Platform.; Publisher: Altium Limited; Supplier 1: Digi-Key; Supplier Part Number 1: 311-10.0KHRCT-ND
R4 R13-R18 R20 R33 R36 R39 R50 R53 R55 R56 R58 = Res-0603-1K: Resistor; Note: Approved sub OK; Published: 8-Jun-2000; Revision: July-2002: Re-released for DXP Platform.; Publisher: Altium Limited; Supplier 1: Digi-Key; Supplier Part Number 1: 311-1.00KHRCT-ND
R7 R8 R31 R34 R37 R46 R48 R51 = Res-0603-22R: Resistor; Note: Approved sub OK; Published: 8-Jun-2000; Revision: July-2002: Re-released for DXP Platform.; Publisher: Altium Limited; Supplier 1: Digi-Key; Supplier Part Number 1: 311-22.0HRCT-ND
R10 R22 R24 R26 R28 R30 R32 R35 R38 R44 R47 R49 R52 = Res-0603-100K: Resistor; Note: Approved sub OK; Published: 8-Jun-2000; Revision: July-2002: Re-released for DXP Platform.; Publisher: Altium Limited; Supplier 1: Digi-Key; Supplier Part Number 1: 311-100KHRCT-ND
R19 = Res-0603-53.6K: Resistor; Note: Approved sub OK; Published: 8-Jun-2000; Revision: July-2002: Re-released for DXP Platform.; Publisher: Altium Limited; Supplier 1: Digi-Key; Supplier Part Number 1: 311-53.6KHRCT-ND
R40-R43 R54 R59 = Res-0603-4K7: Resistor; Note: Approved sub OK; Published: 8-Jun-2000; Revision: July-2002: Re-released for DXP Platform.; Publisher: Altium Limited; Supplier 1: Digi-Key; Supplier Part Number 1: 311-4.7KGRCT-ND
Reset = SW-PB: SMD Tactile Switch; Note: Approved sub OK; Supplier 1: Digi-Key; Supplier Part Number 1: 679-2396-1-ND
sc1-sc4 = Sraf: Note: Approved sub OK
U1 = ATMEGA2560: The high-performance, low-power Atmel 8-bit AVR RISC-based microcontroller; Supplier 1: Digi-Key
U2 = ATMEGA16U2-MU: High Performance, Low Power USB2.0 AVR® 8-Bit Microcontroller; Supplier 1: Digi-Key
U3 = Buck Regulator AOZ1282CI: Supplier 1: Digi-Key; Supplier Part Number 1: 785-1613-1-ND
U4 = Regulator - AOZ1284 4A Buck Regulator: Supplier 1: Digi-Key; Supplier Part Number 1: 785-1689-1-ND
U5 = USBLC6-4SC6 USB ESD Protection: ESD Protection IC; Note: Approved sub OK; Supplier 1: Digi-Key; Supplier Part Number 1: 497-4492-1-ND
USB_AUX = Header 5x1: Header, 5-Pin; Note: Approved sub OK; LatestRevisionDate: 17-Jul-2002; LatestRevisionNote: Re-released for DXP Platform.; Publisher: Altium Limited; Supplier 1: Digi-Key; Supplier Part Number 1: 3M9449-ND
VFA0_sel VFA1_sel VHE2_sel X+ X- Y+ Y- Z+ Z- = Header 3: Header, 3-Pin; Note: Approved sub OK; LatestRevisionDate: 17-Jul-2002; LatestRevisionNote: Re-released for DXP Platform.; Publisher: Altium Limited; Supplier 1: Digi-Key; Supplier Part Number 1: 3M9448-ND
Y1 Y2 = XTAL_2: Crystal Oscillator; Manufacturer: Generic Components; Note: Approved sub OK; Published: 08/06/2000; Publisher: Altium Hobart Technology Centre; Class: Oscillator; SubClass: Crystal Oscillator; Supplier 1: Digi-Key; Supplier Part Number 1: SER3686CT-ND